# EAGLE design display (EAGLE 7.2.0)
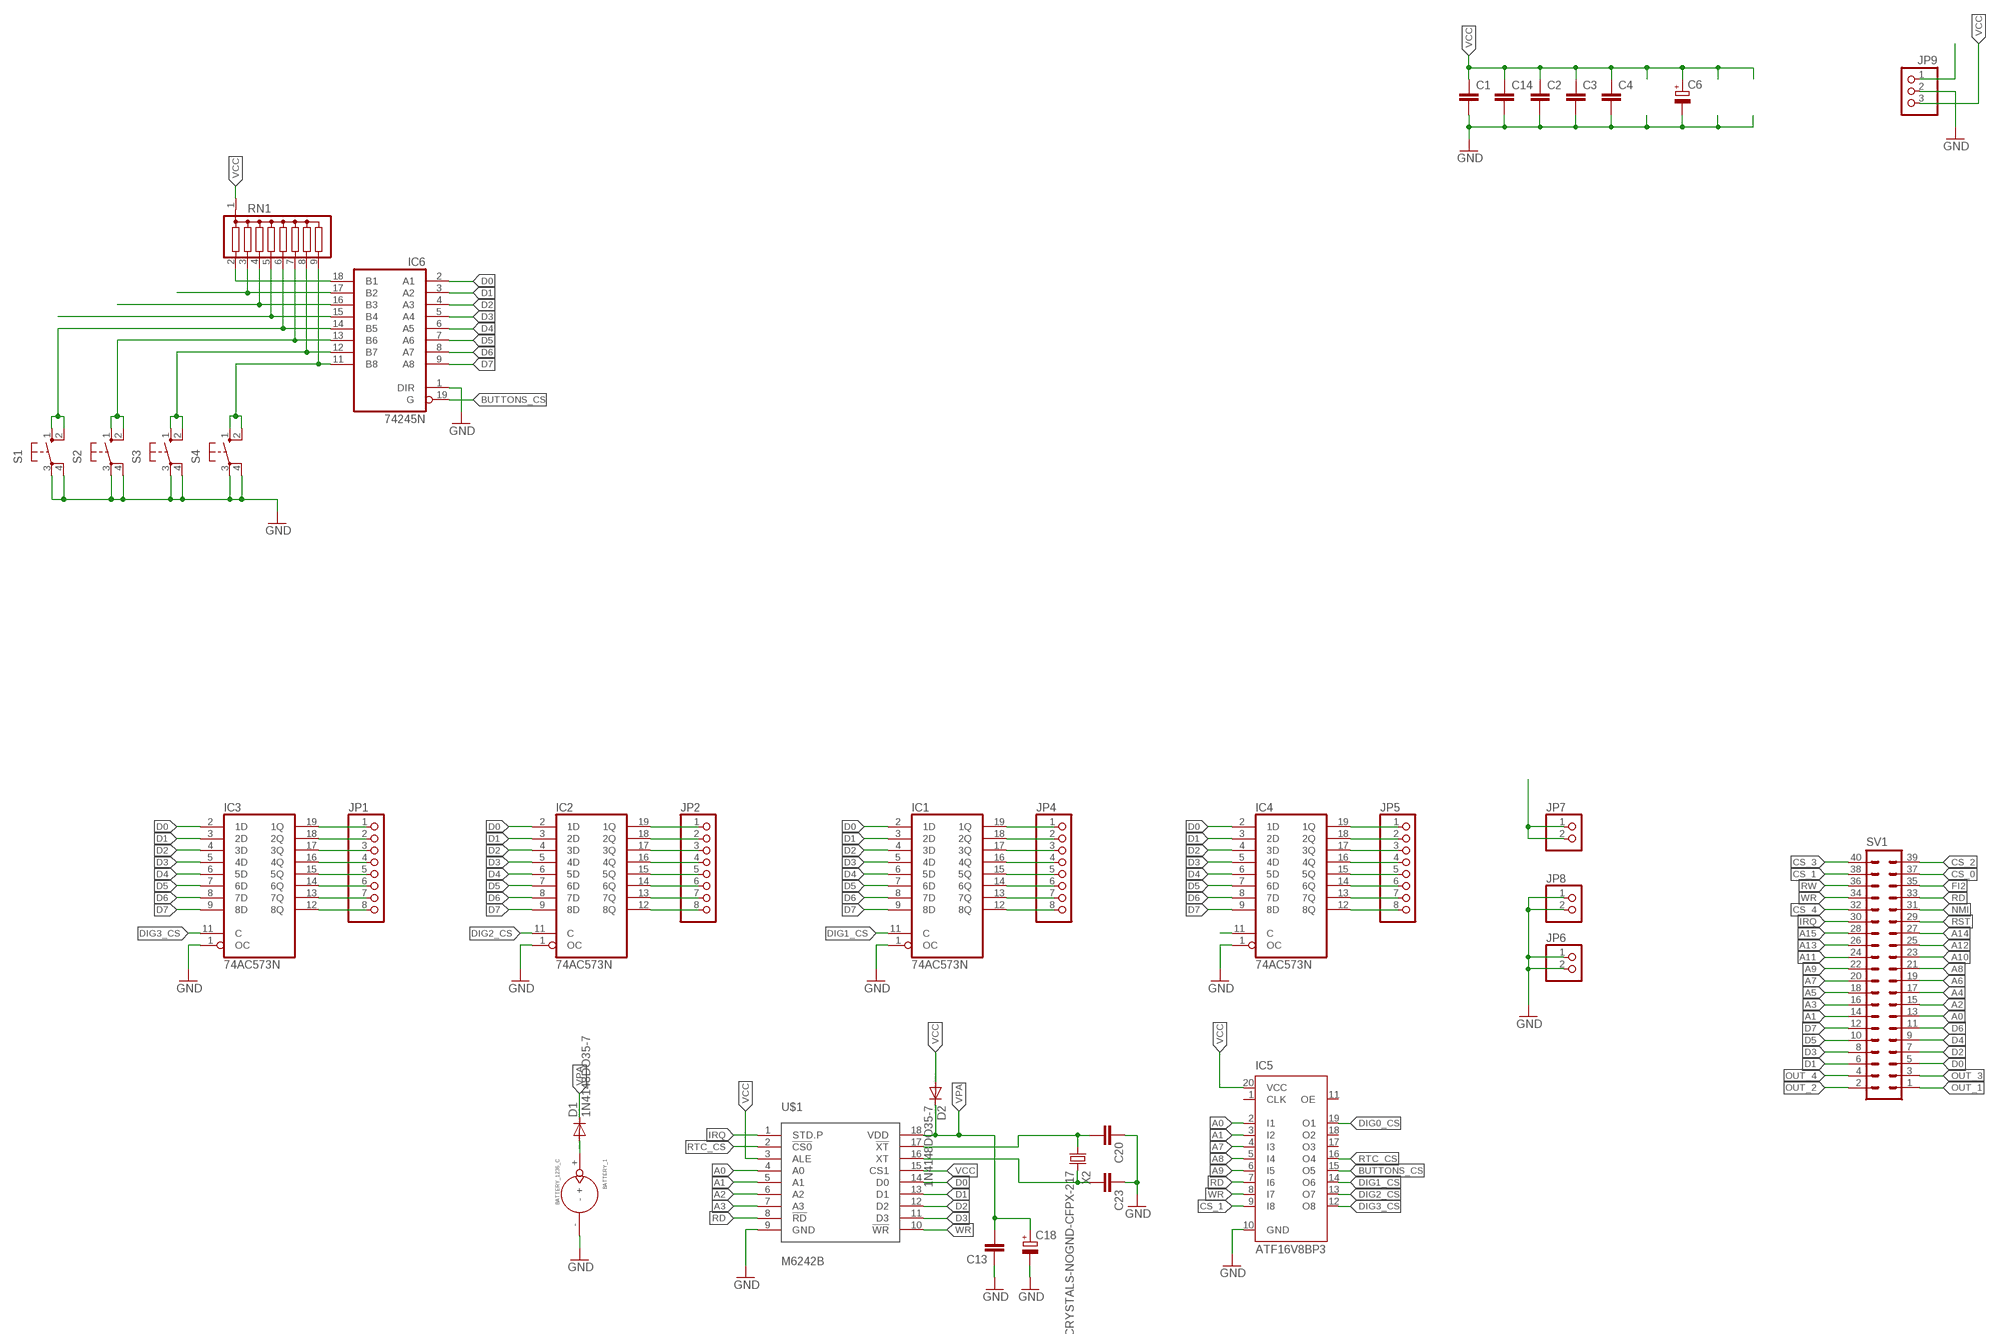
[diagram p0: schematic, sheet 1]

## Parts
BATTERY_1  BATTERY_1236_C  [BATTERY_1236_C]
C1  C-EUC1206  [C1206]
C2  C-EUC1206  [C1206]
C3  C-EUC1206  [C1206]
C4  C-EUC1206  [C1206]
C6  CPOL-EUSMCD  [SMC_D]
C13  C-EUC0603  [C0603]
C14  C-EUC1206  [C1206]
C18  CPOL-EUSMCB  [SMC_B]
C20  C-EUC0603  [C0603]
C23  C-EUC0603  [C0603]
D1  1N4148DO35-7  [DO35-7]
D2  1N4148DO35-7  [DO35-7]
IC1  74AC573N  [DIL20]
IC2  74AC573N  [DIL20]
IC3  74AC573N  [DIL20]
IC4  74AC573N  [DIL20]
IC5  ATF16V8BP3  [DIL20]
IC6  74245N  74LS245N  [DIL20]
JP1  PINHD-1X8  [1X08]
JP2  PINHD-1X8  [1X08]
JP4  PINHD-1X8  [1X08]
JP5  PINHD-1X8  [1X08]
JP6  PINHD-1X2  [1X02]
JP7  PINHD-1X2  [1X02]
JP8  PINHD-1X2  [1X02]
JP9  PINHD-1X3/90  [1X03/90]
RN1  G08R  [SIL9]
S1  40-XX  [B3F-40XX]
S2  40-XX  [B3F-40XX]
S3  40-XX  [B3F-40XX]
S4  40-XX  [B3F-40XX]
SV1  ML40L  [ML40L]
U$1  M6242B  [DIL18]
X2  CRYSTALS-NOGND-CFPX-217  [3.2X1.5-2-PAD]

## Nets
9V: JP7.1 JP7.2 JP9.1
A0: IC5.2(I1) SV1.13 U$1.4(A0)
A1: IC5.3(I2) SV1.14 U$1.5(A1)
A2: SV1.15 U$1.6(A2)
A3: SV1.16 U$1.7(A3)
A4: SV1.17
A5: SV1.18
A6: SV1.19
A7: IC5.4(I3) SV1.20
A8: IC5.5(I4) SV1.21
A9: IC5.6(I5) SV1.22
A10: SV1.23
A11: SV1.24
A12: SV1.25
A13: SV1.26
A14: SV1.27
A15: SV1.28
BUTTONS_CS: IC5.15(O5) IC6.19(G)
CS_0: SV1.37
CS_1: IC5.9(I8) SV1.38
CS_2: SV1.39
CS_3: SV1.40
CS_4: SV1.32
D0: IC1.2(1D) IC2.2(1D) IC3.2(1D) IC4.2(1D) IC6.2(A1) SV1.5 U$1.14(D0)
D1: IC1.3(2D) IC2.3(2D) IC3.3(2D) IC4.3(2D) IC6.3(A2) SV1.6 U$1.13(D1)
D2: IC1.4(3D) IC2.4(3D) IC3.4(3D) IC4.4(3D) IC6.4(A3) SV1.7 U$1.12(D2)
D3: IC1.5(4D) IC2.5(4D) IC3.5(4D) IC4.5(4D) IC6.5(A4) SV1.8 U$1.11(D3)
D4: IC1.6(5D) IC2.6(5D) IC3.6(5D) IC4.6(5D) IC6.6(A5) SV1.9
D5: IC1.7(6D) IC2.7(6D) IC3.7(6D) IC4.7(6D) IC6.7(A6) SV1.10
D6: IC1.8(7D) IC2.8(7D) IC3.8(7D) IC4.8(7D) IC6.8(A7) SV1.11
D7: IC1.9(8D) IC2.9(8D) IC3.9(8D) IC4.9(8D) IC6.9(A8) SV1.12
DIG0_CS: IC4.11(C) IC5.19(O1)
DIG1_CS: IC1.11(C) IC5.14(O6)
DIG2_CS: IC2.11(C) IC5.13(O7)
DIG3_CS: IC3.11(C) IC5.12(O8)
FI2: SV1.35
GND: BATTERY_1.- C1.2 C2.2 C3.2 C4.2 C6.- C13.1 C14.2 C18.- C20.1 C23.1 IC1.1(OC) IC2.1(OC) IC3.1(OC) IC4.1(OC) IC5.10(GND) IC6.1(DIR) JP6.1 JP6.2 JP8.1 JP8.2 JP9.2 S1.3(P) S1.4(P1) S2.3(P) S2.4(P1) S3.3(P) S3.4(P1) S4.3(P) S4.4(P1) U$1.9(GND)
IRQ: SV1.30 U$1.1(STD.P)
N$3: IC3.12(8Q) JP1.8
N$4: IC3.13(7Q) JP1.7
N$5: IC3.14(6Q) JP1.6
N$6: IC3.19(1Q) JP1.1
N$7: IC3.18(2Q) JP1.2
N$8: IC3.17(3Q) JP1.3
N$9: IC3.16(4Q) JP1.4
N$10: IC3.15(5Q) JP1.5
N$28: IC2.17(3Q) JP2.3
N$29: IC2.18(2Q) JP2.2
N$30: IC2.19(1Q) JP2.1
N$31: IC2.16(4Q) JP2.4
N$32: IC2.15(5Q) JP2.5
N$33: IC2.14(6Q) JP2.6
N$34: IC2.13(7Q) JP2.7
N$35: IC2.12(8Q) JP2.8
N$36: IC1.19(1Q) JP4.1
N$38: IC1.18(2Q) JP4.2
N$39: IC1.17(3Q) JP4.3
N$48: IC1.16(4Q) JP4.4
N$49: IC1.15(5Q) JP4.5
N$50: IC1.14(6Q) JP4.6
N$51: IC1.13(7Q) JP4.7
N$52: IC1.12(8Q) JP4.8
N$61: IC4.17(3Q) JP5.3
N$62: IC4.19(1Q) JP5.1
N$63: IC4.18(2Q) JP5.2
N$64: IC4.16(4Q) JP5.4
N$65: IC4.15(5Q) JP5.5
N$66: IC4.14(6Q) JP5.6
N$67: IC4.13(7Q) JP5.7
N$68: IC4.12(8Q) JP5.8
N$69: BATTERY_1.+ D1.A
N$74: IC6.14(B5) RN1.6 S1.1(S) S1.2(S1)
N$75: IC6.13(B6) RN1.7 S2.1(S) S2.2(S1)
N$76: IC6.12(B7) RN1.8 S3.1(S) S3.2(S1)
N$77: IC6.11(B8) RN1.9 S4.1(S) S4.2(S1)
NMI: SV1.31
OUT_1: SV1.1
OUT_2: SV1.2
OUT_3: SV1.3
OUT_4: SV1.4
RD: IC5.7(I6) SV1.33 U$1.8(!RD)
RST: SV1.29
RTC_CS: IC5.16(O4) U$1.2(!CS0)
RW: SV1.36
S1: IC6.15(B4) RN1.5
S2: IC6.16(B3) RN1.4
S3: IC6.17(B2) RN1.3
S4: IC6.18(B1) RN1.2
SOSCI: C20.2 U$1.17(!XT) X2.1
SOSCO: C23.2 U$1.16(XT) X2.2
VCC: C1.1 C2.1 C3.1 C4.1 C6.+ C14.1 D2.A IC5.20(VCC) JP9.3 RN1.1 U$1.3(ALE) U$1.15(CS1)
VPA: C13.2 C18.+ D1.C D2.C U$1.18(VDD)
WR: IC5.8(I7) SV1.34 U$1.10(!WR)
Unconnected: IC5.1(CLK) IC5.11(OE) IC5.17(O3) IC5.18(O2)

## Power pins joined to a net without a drawn wire
GND: IC1.10(GND) IC2.10(GND) IC3.10(GND) IC4.10(GND) IC6.10(GND)
VCC: IC1.20(VCC) IC2.20(VCC) IC3.20(VCC) IC4.20(VCC) IC6.20(VCC)

## Library data of the parts
BATTERY_1 = Itead_BP_110825.lbr:BATTERY_1236_C: SOC004
C1-C4 C13 C14 C20 C23 = rcl:C-EU: CAPACITOR, European symbol
C6 C18 = rcl:CPOL-EU: POLARIZED CAPACITOR, European symbol
D1 D2 = diode:1N4148: DIODE high speed (Philips)
IC1-IC4 = 74xx-eu:74*573: 8-bit D latch BUS DRIVER
IC5 = atmel:ATF16V8B: High perfomance CMOS (electrically erasable) programmable logic device (PLD) ABLE-Atmel-ABEL - P18V8R, P16V8C, P16V8AS, P17V8 COPL Atmel-WinCUPL - G16V8MS, G16V8MA, G16V8AS, G16V8 LOG/IC - GAL16V8_R, GAL16V8_G7, GAL16V8_C), GAL16V8 Tango-PLD - G16V8R, G16V8C, G16V8AS, G16V8 Source: http://www.atmel.com/dyn/resources/prod_documents/DOC0364.PDF; MPN: ATF16V8CZ-15PU; OC_FARNELL: 1551768; OC_NEWARK: 94M6254
IC6 = 74xx-us:74*245: Octal BUS TRANSCEIVER, 3-state
JP1 JP2 JP4 JP5 = pinhead:PINHD-1X8: PIN HEADER
JP6-JP8 = pinhead:PINHD-1X2: PIN HEADER
JP9 = pinhead:PINHD-1X3: PIN HEADER
RN1 = resistor-sil:G08R: SIL RESISTOR; OC_FARNELL: unknown; OC_NEWARK: unknown
S1-S4 = switch-omron:40-XX: OMRON SWITCH; MF: OMRON COMPONENTS USA; MPN: B3F-4000; OC_FARNELL: 176434; OC_NEWARK: 36K3105
SV1 = con-harting-ml:ML40: HARTING; OC_FARNELL: unknown; OC_NEWARK: unknown
U$1 = mw:M6242B
X2 = IQD-Frequency-Products:CRYSTALS-NOGND: CRYSTALS CAN NOT GROUNDED

## Board
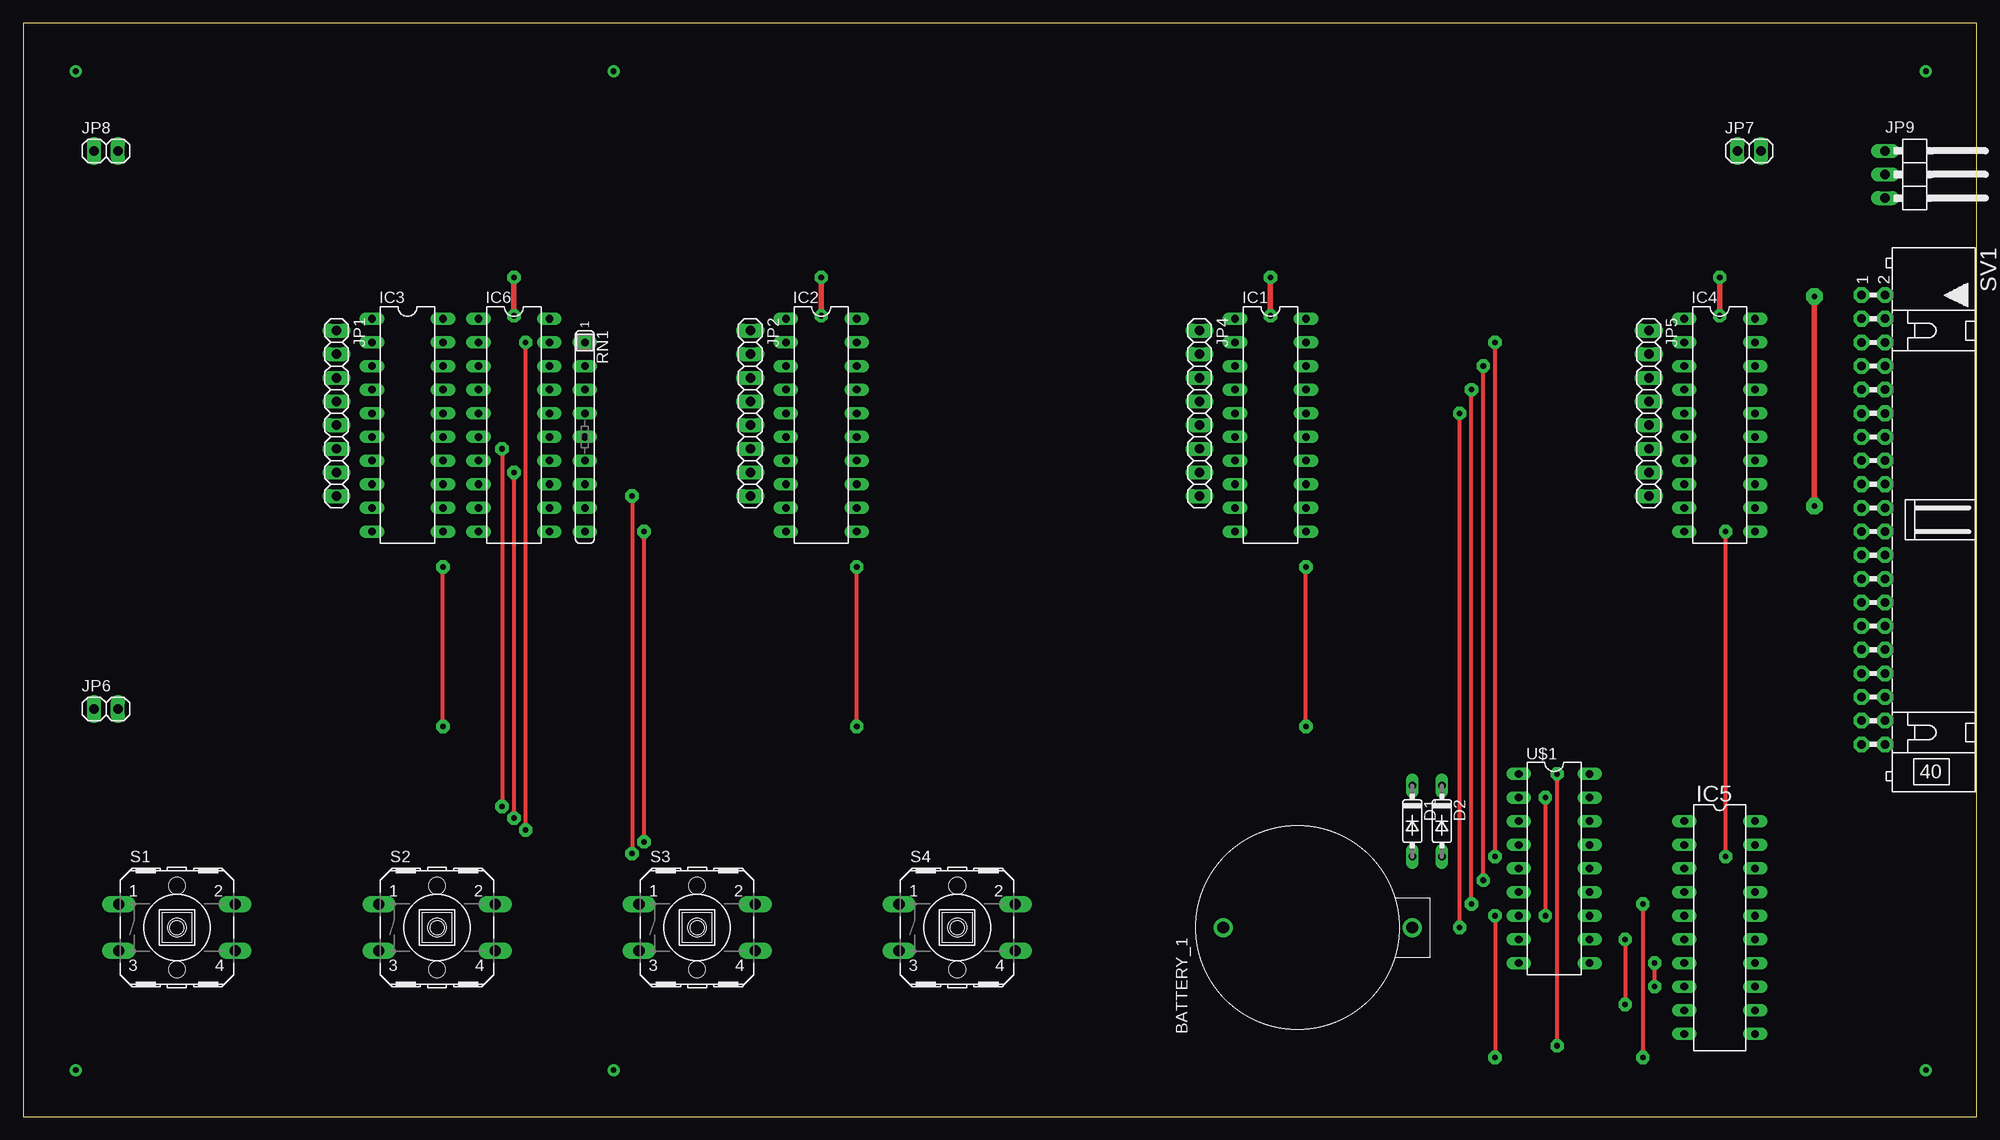
[diagram p1: board, top side]
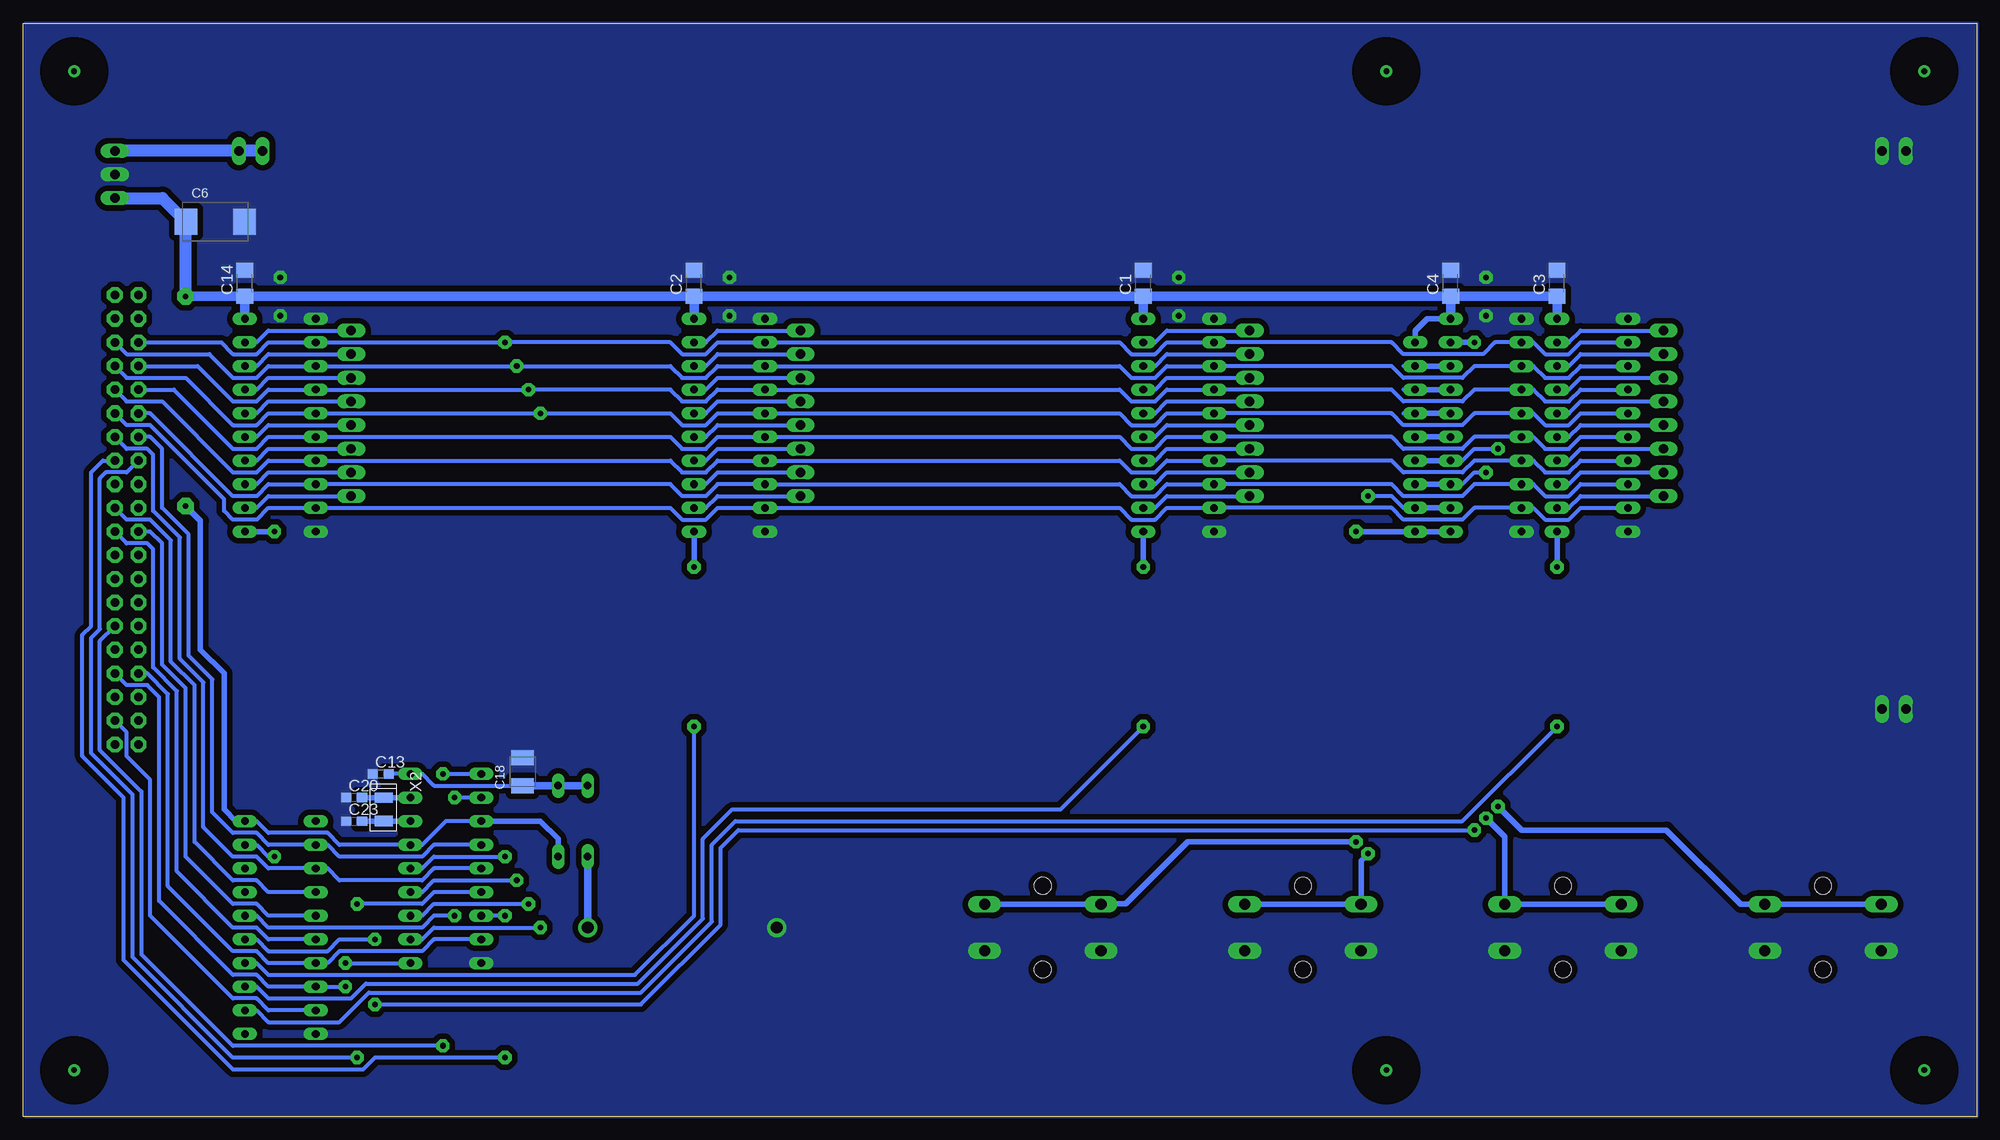
[diagram p2: board, bottom side, seen from below]

Size 209.85 x 117.47 mm. Coordinates in mm from the lower left corner, seen from the top.
Outline: 0,0 209.85,0 209.85,117.47 0,117.47 0,0
Copper layers (1*16): Top 0.035mm / dielectric 1.5mm / Bottom 0.035mm
Design rules "default *": minimum track width 10mil, minimum drill 24mil, track to track 8mil, track to pad 8mil, pad to pad 8mil, via to via 8mil, smd to smd 8mil, copper to edge 0mil, drill to drill 8mil, minimum pad ring 10mil, minimum via ring 8mil, stop-mask expansion 4mil, vias tented up to drill 0mil, thermal gap 10mil
bRestrict: area 60.4,2 to 66.5,8; area 60.4,109.3 to 66.5,115.4; area 201.3,2 to 207.4,8; area 201.3,109.3 to 207.4,115.4; area 2.6,2 to 8.7,8; area 2.6,109.3 to 8.7,115.4

### Footprints (pad centres in the part's own frame; a part is rotated, then mirrored left to right if it is on the bottom)
BATTERY_1236_C = drill 1.27 pad 2.032: + 0,0; - 0,20.32
C1206 = smd 1.6 x 1.8: 1 -1.4,0; 2 1.4,0
SMC_D = smd 2.4 x 2.8: + -3.15,0; - 3.15,0
C0603 = smd 1.1 x 1: 1 -0.85,0; 2 0.85,0
SMC_B = smd 1.6 x 2.4: + -1.5,0; - 1.5,0
DO35-7 = drill 0.813 long: A 3.81,0; C -3.81,0
DIL20 = drill 0.813 long: 1 -11.43,-3.81; 2 -8.89,-3.81; 3 -6.35,-3.81; 4 -3.81,-3.81; 5 -1.27,-3.81; 6 1.27,-3.81; 7 3.81,-3.81; 8 6.35,-3.81; 9 8.89,-3.81; 10 11.43,-3.81; 11 11.43,3.81; 12 8.89,3.81; 13 6.35,3.81; 14 3.81,3.81; 15 1.27,3.81; 16 -1.27,3.81; 17 -3.81,3.81; 18 -6.35,3.81; 19 -8.89,3.81; 20 -11.43,3.81
1X08 = drill 1.016 long: 1 -8.89,0; 2 -6.35,0; 3 -3.81,0; 4 -1.27,0; 5 1.27,0; 6 3.81,0; 7 6.35,0; 8 8.89,0
1X02 = drill 1.016 long: 1 -1.27,0; 2 1.27,0
1X03/90 = drill 1.016 long: 1 -2.54,-3.81; 2 0,-3.81; 3 2.54,-3.81
SIL9 = drill 0.813 long: 1 -10.16,0; 2 -7.62,0; 3 -5.08,0; 4 -2.54,0; 5 0,0; 6 2.54,0; 7 5.08,0; 8 7.62,0; 9 10.16,0
B3F-40XX = drill 1.194 long: 1 -6.248,2.489; 2 6.248,2.489; 3 -6.248,-2.489; 4 6.248,-2.489 | hole 1.803: 0,-4.496; 0,4.496
ML40L = drill 0.914 pad 1.676 octagon: 1 -24.13,-1.27; 2 -24.13,1.27; 3 -21.59,-1.27; 4 -21.59,1.27; 5 -19.05,-1.27; 6 -19.05,1.27; 7 -16.51,-1.27; 8 -16.51,1.27; 9 -13.97,-1.27; 10 -13.97,1.27; 11 -11.43,-1.27; 12 -11.43,1.27; 13 -8.89,-1.27; 14 -8.89,1.27; 15 -6.35,-1.27; 16 -6.35,1.27; 17 -3.81,-1.27; 18 -3.81,1.27; 19 -1.27,-1.27; 20 -1.27,1.27; 21 1.27,-1.27; 22 1.27,1.27; 23 3.81,-1.27; 24 3.81,1.27; 25 6.35,-1.27; 26 6.35,1.27; 27 8.89,-1.27; 28 8.89,1.27; 29 11.43,-1.27; 30 11.43,1.27; 31 13.97,-1.27; 32 13.97,1.27; 33 16.51,-1.27; 34 16.51,1.27; 35 19.05,-1.27; 36 19.05,1.27; 37 21.59,-1.27; 38 21.59,1.27; 39 24.13,-1.27; 40 24.13,1.27
DIL18 = drill 0.813 long: 1 -10.16,-3.81; 2 -7.62,-3.81; 3 -5.08,-3.81; 4 -2.54,-3.81; 5 0,-3.81; 6 2.54,-3.81; 7 5.08,-3.81; 8 7.62,-3.81; 9 10.16,-3.81; 10 10.16,3.81; 11 7.62,3.81; 12 5.08,3.81; 13 2.54,3.81; 14 0,3.81; 15 -2.54,3.81; 16 -5.08,3.81; 17 -7.62,3.81; 18 -10.16,3.81
3.2X1.5-2-PAD = smd 1.1 x 1.9: 1 -1.25,0; 2 1.25,0

### Placement (x,y rotation side)
BATTERY_1  149.22,20.32 90 top
C1  89.53,89.53 90 bottom
C2  137.79,89.53 90 bottom
C3  45.09,89.53 90 bottom
C4  56.52,89.53 90 bottom
C6  189.23,96.14 0 bottom
C13  171.45,36.83 0 bottom
C14  186.06,89.53 90 bottom
C18  156.21,37.07 90 bottom
C20  174.31,34.29 0 bottom
C23  174.31,31.75 0 bottom
D1  149.22,31.75 270 top
D2  152.4,31.75 270 top
IC1  133.99,74.3 270 top
IC2  85.72,74.3 270 top
IC3  41.27,74.3 270 top
IC4  182.25,74.3 270 top
IC5  182.25,20.32 270 top
IC6  52.7,74.3 270 top
JP1  33.66,75.56 270 top
JP2  78.11,75.56 270 top
JP4  126.36,75.56 270 top
JP5  174.62,75.56 270 top
JP6  8.89,43.81 0 top
JP7  185.42,103.76 0 top
JP8  8.89,103.76 0 top
JP9  203.84,101.22 270 top
RN1  60.33,73.03 270 top
S1  16.51,20.32 0 top
S2  44.45,20.32 0 top
S3  72.39,20.32 0 top
S4  100.33,20.32 0 top
SV1  198.75,64.14 270 top
U$1  164.47,26.67 270 top
X2  171.13,33.02 270 bottom

### Tracks (layer width: path | path; a pad name or v marks a point on that pad's centre or on a via)
9V
  Bottom 1.27: JP7.1 JP7.2 JP9.1
A0
  Bottom 0.406: SV1.13 196.22,73.03 194.94,71.75 194.94,65.41 192.09,62.55 192.09,49.53 189.55,46.99 189.55,32.7 187.32,30.48 184.78,30.48 183.51,29.21 IC5.2 177.16,29.21 175.9,27.94 167,27.94 165.74,29.21 U$1.4
A1
  Bottom 0.406: SV1.14 198.75,71.75 196.53,71.75 195.9,71.12 195.9,65.09 193.04,62.23 193.04,49.21 190.5,46.67 190.5,31.11 187.32,27.94 184.78,27.94 183.51,26.67 IC5.3 177.16,26.67 175.9,25.4 167,25.4 165.74,26.67 U$1.5
A2  (via drill 0.6 pad 1.42)
  Top 0.406: v173.99,22.86 v173.99,6.35
  Bottom 0.406: SV1.15 198.75,69.22 200.98,69.22 201.61,68.58 201.61,52.39 202.56,51.44 202.56,39.05 198.12,34.61 198.12,17.14 187.32,6.35 v173.99,6.35 | U$1.6 165.74,24.13 167,22.86 v173.99,22.86
A3  (via drill 0.6 pad 1.42)
  Top 0.406: v158.12,21.59 v158.12,6.35
  Bottom 0.406: SV1.16 201.29,70.48 202.56,69.22 202.56,52.7 203.52,51.75 203.52,38.73 199.07,34.29 199.07,16.83 187.32,5.08 173.35,5.08 172.09,6.35 v158.12,6.35 | v158.12,21.59 U$1.7
A7
  Bottom 0.406: IC5.4 183.51,24.13 184.78,25.4 187.32,25.4 191.45,29.53 191.45,46.35 193.99,48.9 193.99,61.91 196.22,64.14 198.75,64.14 SV1.20
A8
  Bottom 0.406: IC5.5 183.51,21.59 184.78,22.86 187.32,22.86 192.41,27.94 192.41,46.04 194.94,48.58 194.94,61.59 196.22,62.87 SV1.21
A9
  Bottom 0.406: IC5.6 183.51,19.05 184.78,20.32 187.32,20.32 193.36,26.35 193.36,45.72 195.9,48.26 195.9,60.96 196.53,61.59 198.75,61.59 SV1.22
BUTTONS_CS  (via drill 0.6 pad 1.42)
  Top 0.406: v172.09,19.05 v172.09,12.06 | v53.98,30.8 v53.98,83.19
  Bottom 0.406: IC5.15 184.78,19.05 183.51,17.78 177.16,17.78 175.9,19.05 v172.09,19.05 | v172.09,12.06 143.51,12.06 134.94,20.64 134.94,28.89 133.03,30.8 v53.98,30.8
  Bottom 0.61: v53.98,83.19 IC6.19
CS_1
  Bottom 0.406: IC5.9 183.51,11.43 184.78,12.7 187.32,12.7 196.22,21.59 196.22,36.2 198.75,38.73 198.75,41.27 SV1.38
D0  (via drill 0.6 pad 1.42)
  Top 0.406: v158.12,27.94 v158.12,83.19
  Bottom 0.406: IC3.2 42.55,83.19 43.81,81.92 46.35,81.92 47.62,83.19 IC6.2 51.75,83.19 53.02,81.92 61.59,81.92 62.87,83.19 IC2.2 87,83.19 88.27,81.92 90.81,81.92 92.08,83.19 IC1.2 135.25,83.19 136.53,81.92 139.06,81.92 140.34,83.19 v158.12,83.19 IC4.2 183.51,83.19 184.78,81.92 187.32,81.92 188.59,83.19 SV1.5 | U$1.14 167,26.67 165.74,27.94 v158.12,27.94
D1  (via drill 0.6 pad 1.42)
  Top 0.406: v156.84,25.4 v156.84,80.64
  Bottom 0.406: IC3.3 42.55,80.64 43.81,79.38 46.35,79.38 47.62,80.64 IC6.3 53.98,80.64 55.24,79.38 61.59,79.38 62.87,80.64 IC2.3 87,80.64 88.27,79.38 90.81,79.38 92.08,80.64 IC1.3 135.25,80.64 136.53,79.38 139.06,79.38 140.34,80.64 v156.84,80.64 IC4.3 183.51,80.64 184.78,79.38 187.32,79.38 189.87,81.92 198.75,81.92 SV1.6 | U$1.13 167,24.13 165.74,25.4 v156.84,25.4
D2  (via drill 0.6 pad 1.42)
  Top 0.406: v155.57,22.86 v155.57,78.11
  Bottom 0.406: IC3.4 42.55,78.11 43.81,76.83 46.35,76.83 47.62,78.11 IC6.4 53.98,78.11 55.24,76.83 61.59,76.83 62.87,78.11 IC2.4 87,78.11 88.27,76.83 90.81,76.83 92.08,78.11 IC1.4 135.25,78.11 136.53,76.83 139.06,76.83 140.34,78.11 v155.57,78.11 IC4.4 183.51,78.11 184.78,76.83 187.32,76.83 191.13,80.64 SV1.7 | U$1.12 167,21.59 165.74,22.86 v155.57,22.86
D3  (via drill 0.6 pad 1.42)
  Top 0.406: v154.31,20.32 v154.31,75.56
  Bottom 0.406: IC3.5 42.55,75.56 43.81,74.3 46.35,74.3 47.62,75.56 IC6.5 53.98,75.56 55.24,74.3 61.59,74.3 62.87,75.56 IC2.5 87,75.56 88.27,74.3 90.81,74.3 92.08,75.56 IC1.5 135.25,75.56 136.53,74.3 139.06,74.3 140.34,75.56 v154.31,75.56 IC4.5 183.51,75.56 184.78,74.3 187.32,74.3 192.41,79.38 198.75,79.38 SV1.8 | U$1.11 167,19.05 165.74,20.32 v154.31,20.32
D4
  Bottom 0.406: IC3.6 42.55,73.03 43.81,71.75 46.35,71.75 47.62,73.03 IC6.6 53.98,73.03 55.24,71.75 61.59,71.75 62.87,73.03 IC2.6 87,73.03 88.27,71.75 90.81,71.75 92.08,73.03 IC1.6 135.25,73.03 136.53,71.75 139.06,71.75 140.34,73.03 IC4.6 183.51,73.03 184.78,71.75 187.32,71.75 193.68,78.11 SV1.9
D5
  Bottom 0.406: IC3.7 42.55,70.48 43.81,69.22 46.35,69.22 47.62,70.48 IC6.7 53.98,70.48 55.24,69.22 61.59,69.22 62.87,70.48 IC2.7 87,70.48 88.27,69.22 90.81,69.22 92.08,70.48 IC1.7 135.25,70.48 136.53,69.22 139.06,69.22 140.34,70.48 IC4.7 183.51,70.48 184.78,69.22 187.32,69.22 194.94,76.83 198.75,76.83 SV1.10
D6
  Bottom 0.406: IC3.8 42.55,67.94 43.81,66.67 46.35,66.67 47.62,67.94 IC6.8 53.98,67.94 55.24,66.67 61.59,66.67 62.87,67.94 IC2.8 87,67.94 88.27,66.67 90.81,66.67 92.08,67.94 IC1.8 135.25,67.94 136.53,66.67 139.06,66.67 140.34,67.94 IC4.8 183.51,67.94 184.78,66.67 187.32,66.67 196.22,75.56 SV1.11
D7
  Bottom 0.406: IC3.9 42.55,65.41 43.81,64.14 46.35,64.14 47.62,65.41 IC6.9 53.98,65.41 55.24,64.14 61.59,64.14 62.87,65.41 IC2.9 87,65.41 88.27,64.14 90.81,64.14 92.08,65.41 IC1.9 135.25,65.41 136.53,64.14 139.06,64.14 140.34,65.41 IC4.9 183.51,65.41 184.78,64.14 187.32,64.14 188.28,65.09 188.28,66.36 196.22,74.3 198.75,74.3 SV1.12
DIG0_CS  (via drill 0.6 pad 1.42)
  Top 0.406: v182.88,27.94 v182.88,62.87
  Bottom 0.406: v182.88,27.94 183.51,27.94 184.78,29.21 IC5.19
  Bottom 0.61: IC4.11 v182.88,62.87
DIG1_CS  (via drill 0.6 pad 1.42)
  Top 0.406: v137.79,41.91 v137.79,59.05
  Bottom 0.406: IC5.14 184.78,16.51 183.51,15.24 144.15,15.24 137.79,21.59 v137.79,41.91
  Bottom 0.61: v137.79,59.05 IC1.11
DIG2_CS  (via drill 0.6 pad 1.42)
  Top 0.406: v89.53,41.91 v89.53,59.05
  Bottom 0.406: IC5.13 184.78,13.97 183.51,12.7 174.62,12.7 173.04,14.29 143.83,14.29 136.84,21.27 136.84,29.84 133.67,33.02 98.42,33.02 v89.53,41.91
  Bottom 0.61: v89.53,59.05 IC2.11
DIG3_CS  (via drill 0.6 pad 1.42)
  Top 0.406: v45.09,41.91 v45.09,59.05
  Bottom 0.406: IC5.12 184.78,11.43 183.51,10.16 175.9,10.16 172.72,13.34 143.51,13.34 135.89,20.95 135.89,29.21 133.35,31.75 55.24,31.75 v45.09,41.91
  Bottom 0.61: v45.09,59.05 IC3.11
GND  (via drill 0.6 pad 1.42)
  Top 0.61: v182.25,86.04 v182.25,90.17 | v85.72,86.04 v85.72,90.17 | v133.99,86.04 v133.99,90.17 | v52.7,90.17 v52.7,86.04
  pour Bottom (isolate 0.61, no thermals): 0,117.47 0,0 209.55,0 209.55,117.47
IRQ  (via drill 0.6 pad 1.42)
  Top 0.406: v164.78,7.62 v164.78,36.83
  Bottom 0.406: v164.78,36.83 U$1.1 | v164.78,7.62 187.32,7.62 197.17,17.46 197.17,34.92 201.61,39.37 201.61,51.12 SV1.30
N$3
  Bottom 0.406: IC3.12 43.81,65.41 42.55,66.67 JP1.8
N$4
  Bottom 0.406: IC3.13 43.81,67.94 42.55,69.22 JP1.7
N$5
  Bottom 0.406: IC3.14 43.81,70.48 42.55,71.75 JP1.6
N$6
  Bottom 0.406: IC3.19 43.81,83.19 42.55,84.45 JP1.1
N$7
  Bottom 0.406: IC3.18 43.81,80.64 42.55,81.92 JP1.2
N$8
  Bottom 0.406: IC3.17 43.81,78.11 42.55,79.38 JP1.3
N$9
  Bottom 0.406: IC3.16 43.81,75.56 42.55,76.83 JP1.4
N$10
  Bottom 0.406: IC3.15 43.81,73.03 42.55,74.3 JP1.5
N$23  (via drill 0.6 pad 1.27)
  other vias: 63.42,112.31
N$24  (via drill 0.6 pad 1.27)
  other vias: 204.39,5
N$25  (via drill 0.6 pad 1.27)
  other vias: 204.39,112.31
N$28
  Bottom 0.406: IC2.17 88.27,78.11 87,79.38 JP2.3
N$29
  Bottom 0.406: IC2.18 88.27,80.64 87,81.92 JP2.2
N$30
  Bottom 0.406: IC2.19 88.27,83.19 87,84.45 JP2.1
N$31
  Bottom 0.406: IC2.16 88.27,75.56 87,76.83 JP2.4
N$32
  Bottom 0.406: IC2.15 88.27,73.03 87,74.3 JP2.5
N$33
  Bottom 0.406: IC2.14 88.27,70.48 87,71.75 JP2.6
N$34
  Bottom 0.406: IC2.13 88.27,67.94 87,69.22 JP2.7
N$35
  Bottom 0.406: IC2.12 88.27,65.41 87,66.67 JP2.8
N$36
  Bottom 0.406: IC1.19 136.53,83.19 135.25,84.45 JP4.1
N$37  (via drill 0.6 pad 1.27)
  other vias: 63.42,5
N$38
  Bottom 0.406: IC1.18 136.53,80.64 135.25,81.92 JP4.2
N$39
  Bottom 0.406: IC1.17 136.53,78.11 135.25,79.38 JP4.3
N$48
  Bottom 0.406: IC1.16 136.53,75.56 135.25,76.83 JP4.4
N$49
  Bottom 0.406: IC1.15 136.53,73.03 135.25,74.3 JP4.5
N$50
  Bottom 0.406: IC1.14 136.53,70.48 135.25,71.75 JP4.6
N$51
  Bottom 0.406: IC1.13 136.53,67.94 135.25,69.22 JP4.7
N$52
  Bottom 0.406: IC1.12 136.53,65.41 135.25,66.67 JP4.8
N$61
  Bottom 0.406: IC4.17 184.78,78.11 183.51,79.38 JP5.3
N$62
  Bottom 0.406: IC4.19 184.78,83.19 183.51,84.45 JP5.1
N$63
  Bottom 0.406: IC4.18 184.78,80.64 183.51,81.92 JP5.2
N$64
  Bottom 0.406: IC4.16 184.78,75.56 183.51,76.83 JP5.4
N$65
  Bottom 0.406: IC4.15 184.78,73.03 183.51,74.3 JP5.5
N$66
  Bottom 0.406: IC4.14 184.78,70.48 183.51,71.75 JP5.6
N$67
  Bottom 0.406: IC4.13 184.78,67.94 183.51,69.22 JP5.7
N$68
  Bottom 0.406: IC4.12 184.78,65.41 183.51,66.67 JP5.8
N$69
  Bottom 0.813: D1.A BATTERY_1.+
N$70  (via drill 0.6 pad 1.27)
  other vias: 5.63,5
N$72  (via drill 0.6 pad 1.27)
  other vias: 5.63,112.31
N$74  (via drill 0.6 pad 1.42)
  Top 0.406: v51.44,71.75 v51.44,33.34
  Bottom 0.406: IC6.14 55.24,70.48 53.98,71.75 v51.44,71.75
  Bottom 0.61: IC6.14 RN1.6 | v51.44,33.34 48.9,30.8 33.34,30.8 25.35,22.81 S1.2 S1.1
N$75  (via drill 0.6 pad 1.42)
  Top 0.406: v52.7,69.22 v52.7,32.07
  Bottom 0.406: IC6.13 55.24,67.94 53.98,69.22 v52.7,69.22
  Bottom 0.61: IC6.13 RN1.7 | v52.7,32.07 50.7,30.06 S2.2 S2.1
N$76  (via drill 0.6 pad 1.42)
  Top 0.406: v65.41,66.67 v65.41,28.26
  Bottom 0.406: RN1.8 61.59,65.41 62.87,66.67 v65.41,66.67
  Bottom 0.61: IC6.12 RN1.8 | S3.2 S3.1 66.14,27.52 v65.41,28.26
N$77  (via drill 0.6 pad 1.42)
  Top 0.406: v66.67,62.87 v66.67,29.53
  Bottom 0.406: 94.03,22.86 S4.1
  Bottom 0.61: IC6.11 RN1.9 v66.67,62.87 | v66.67,29.53 84.77,29.53 91.44,22.86 94.03,22.86 | S4.1 S4.2
RD
  Bottom 0.406: SV1.33 196.53,47.62 194.31,45.4 194.31,24.77 187.32,17.78 184.78,17.78 183.51,16.51 IC5.7 177.16,16.51 175.9,17.78 167,17.78 165.74,19.05 U$1.8
RTC_CS  (via drill 0.6 pad 1.42)
  Top 0.406: v163.51,34.29 v163.51,21.59
  Bottom 0.406: v163.51,21.59 165.74,21.59 167,20.32 183.51,20.32 184.78,21.59 IC5.16 | U$1.2 v163.51,34.29
S1
  Bottom 0.61: IC6.15 RN1.5
S2
  Bottom 0.406: RN1.4 61.59,75.56
  Bottom 0.61: IC6.16 RN1.4
S3
  Bottom 0.406: RN1.3 61.59,78.11
  Bottom 0.61: IC6.17 RN1.3
S4
  Bottom 0.406: RN1.2 61.59,80.64
  Bottom 0.61: IC6.18 RN1.2
SOSCI
  Bottom 0.61: U$1.17 171.45,34.29 | 171.45,34.29 C20.2 | X2.1 171.43,34.27 171.45,34.29
SOSCO
  Bottom 0.61: C23.2 171.45,31.75 | 171.45,31.75 U$1.16 | X2.2 171.43,31.77 171.45,31.75
VCC  (via drill 0.6 pad 1.78)
  Top 0.61: v192.41,65.59 v192.41,88.14
  Bottom 0.406: U$1.3 164.47,31.75 167,29.21 U$1.15 175.9,29.21 177.16,30.48 183.51,30.48 184.78,31.75 IC5.20
  Bottom 0.61: U$1.3 154.31,31.75 152.4,29.84 D2.A | v192.41,65.59 190.82,64 190.82,50.16 188.28,47.62 188.28,33.02 187.01,31.75 IC5.20 | RN1.1 60.33,84.45 59.05,85.72 IC6.20
  Bottom 1.016: C4.1 C1.1 | C1.1 C2.1 | IC3.20 C3.1 C4.1 | IC2.20 C1.1 | IC1.20 C2.1 | IC4.20 C14.1 | C14.1 v192.41,88.14 | C4.1 IC6.20 | C2.1 C14.1
  Bottom 1.27: v192.41,88.14 192.41,96.14 C6.+ 194.92,98.68 JP9.3
VPA
  Bottom 0.406: C13.2 U$1.18 167,36.83 165.74,35.56 156.22,35.56 C18.+
  Bottom 0.61: C18.+
  Bottom 0.813: D1.C D2.C C18.+
WR  (via drill 0.6 pad 1.42)
  Top 0.406: v175.26,13.97 v175.26,16.51
  Bottom 0.406: SV1.34 198.75,46.35 196.53,46.35 195.26,45.09 195.26,23.18 187.32,15.24 184.78,15.24 183.51,13.97 IC5.8 v175.26,13.97 | v175.26,16.51 U$1.10